# Altium schematic sheet robot.schdoc
size 570 x 404 mm
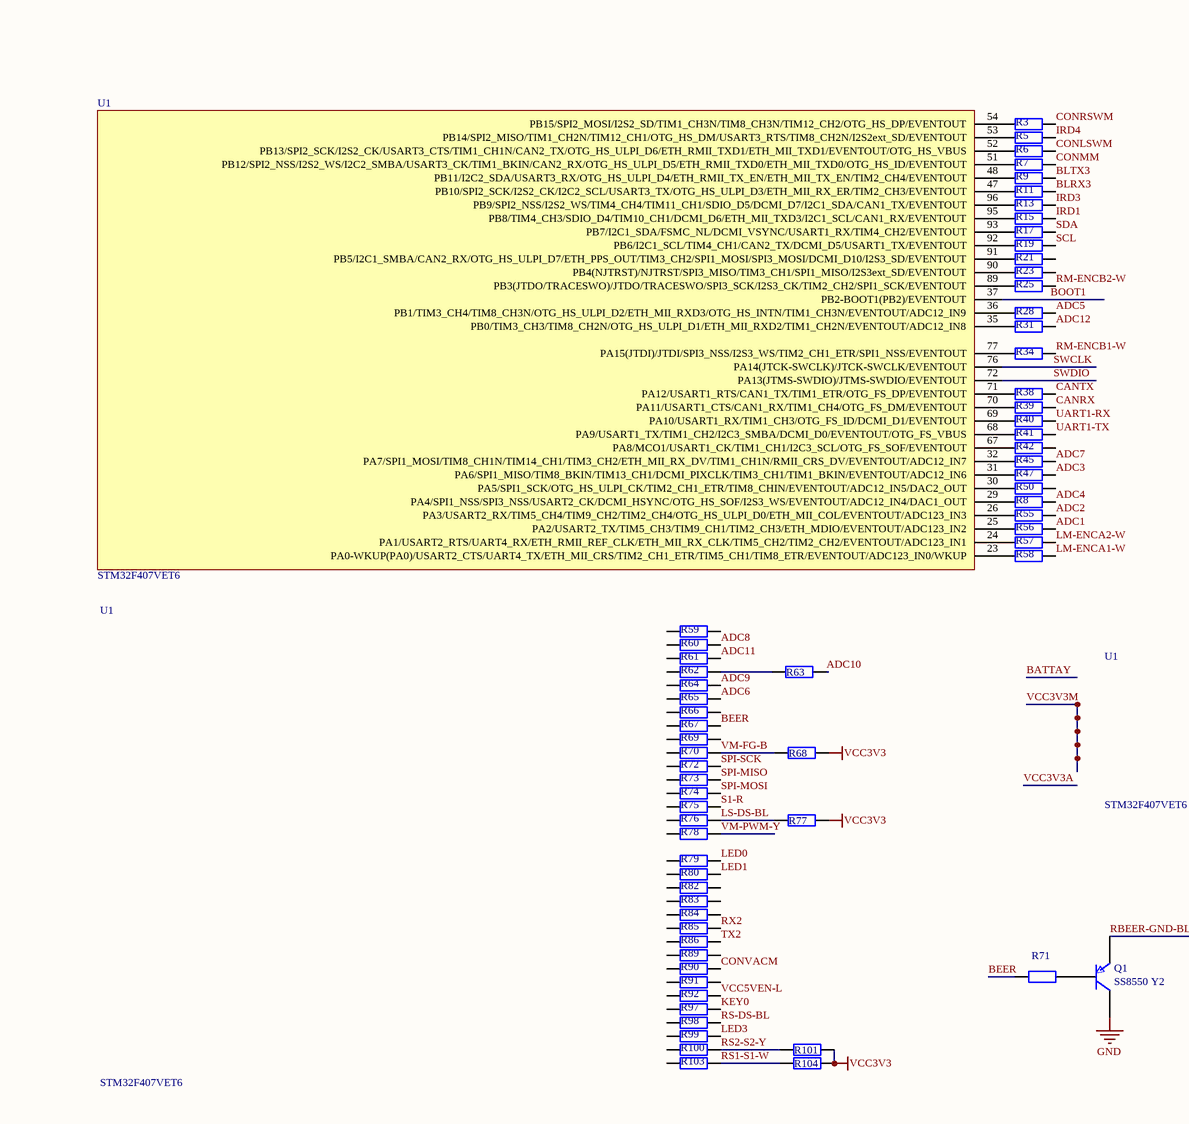
[diagram p0: robot.schdoc, top left]
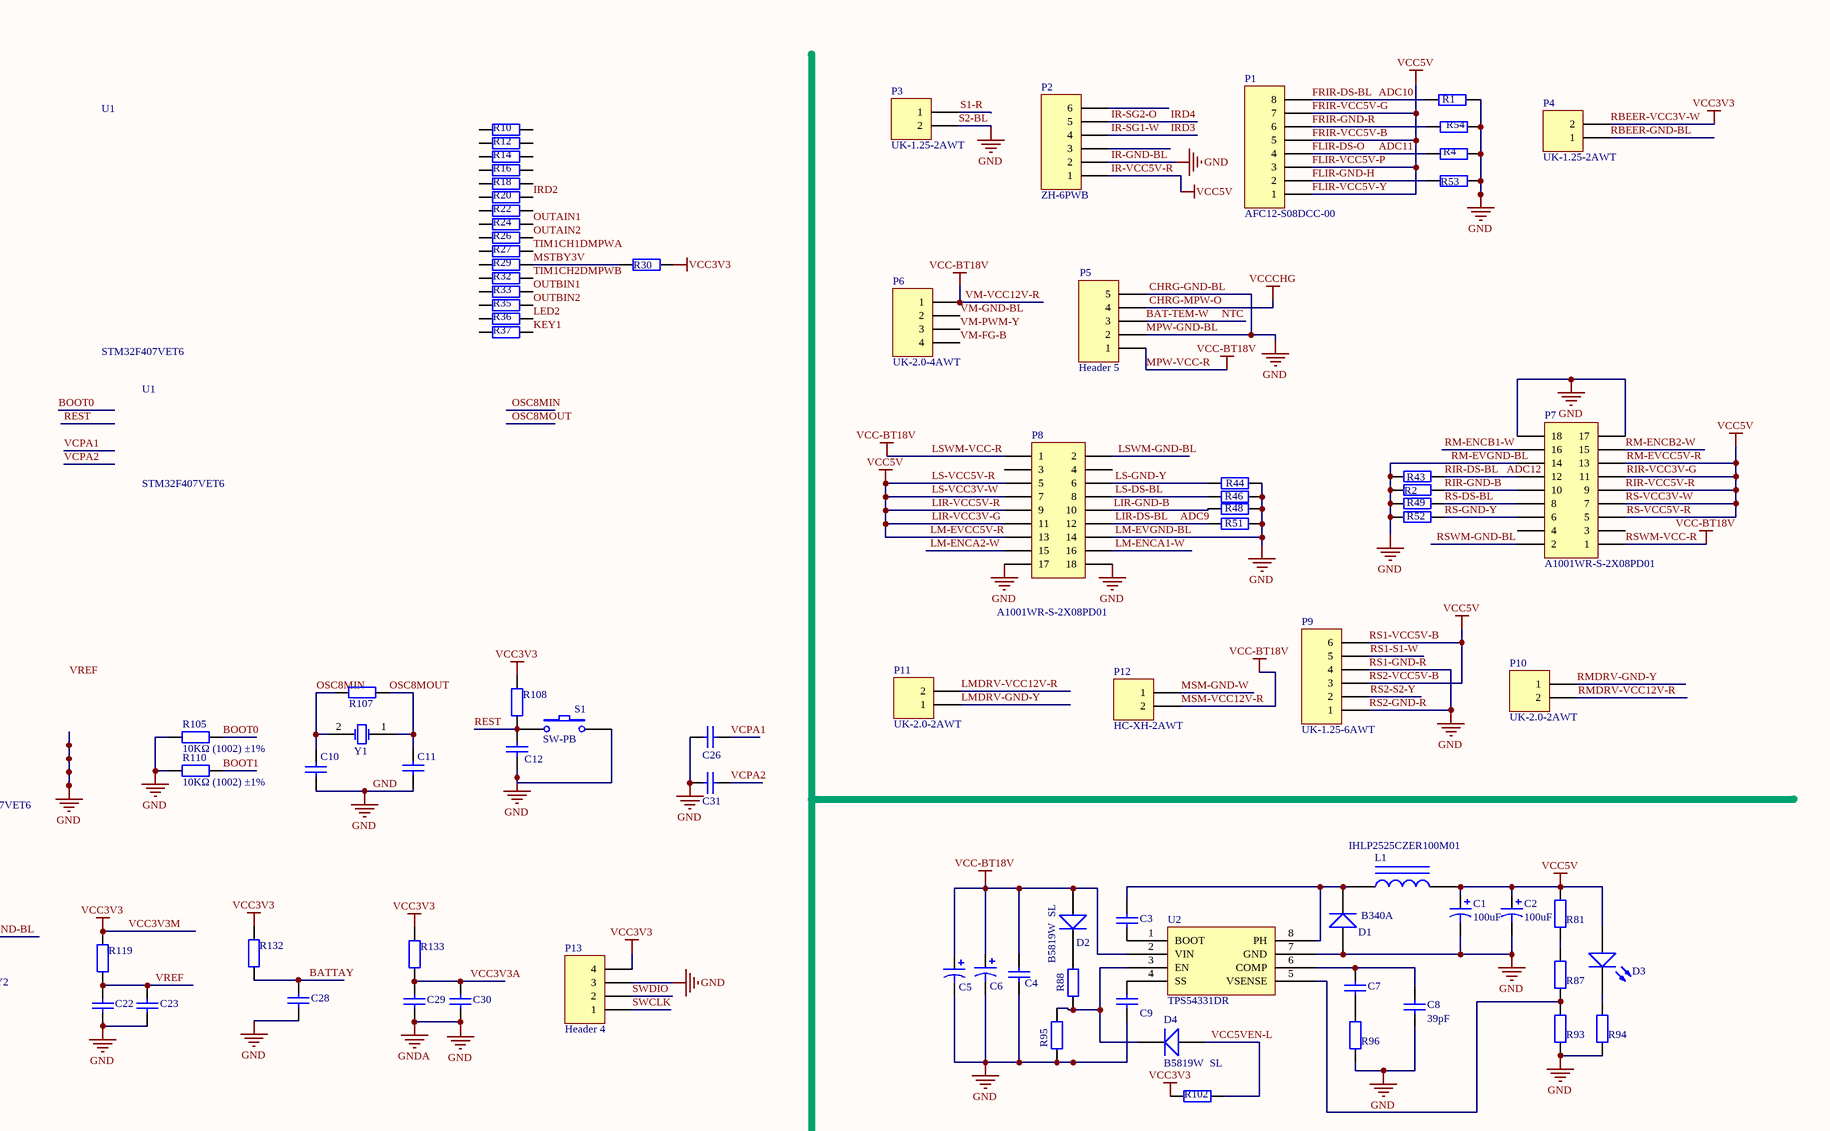
[diagram p1: robot.schdoc, top right]
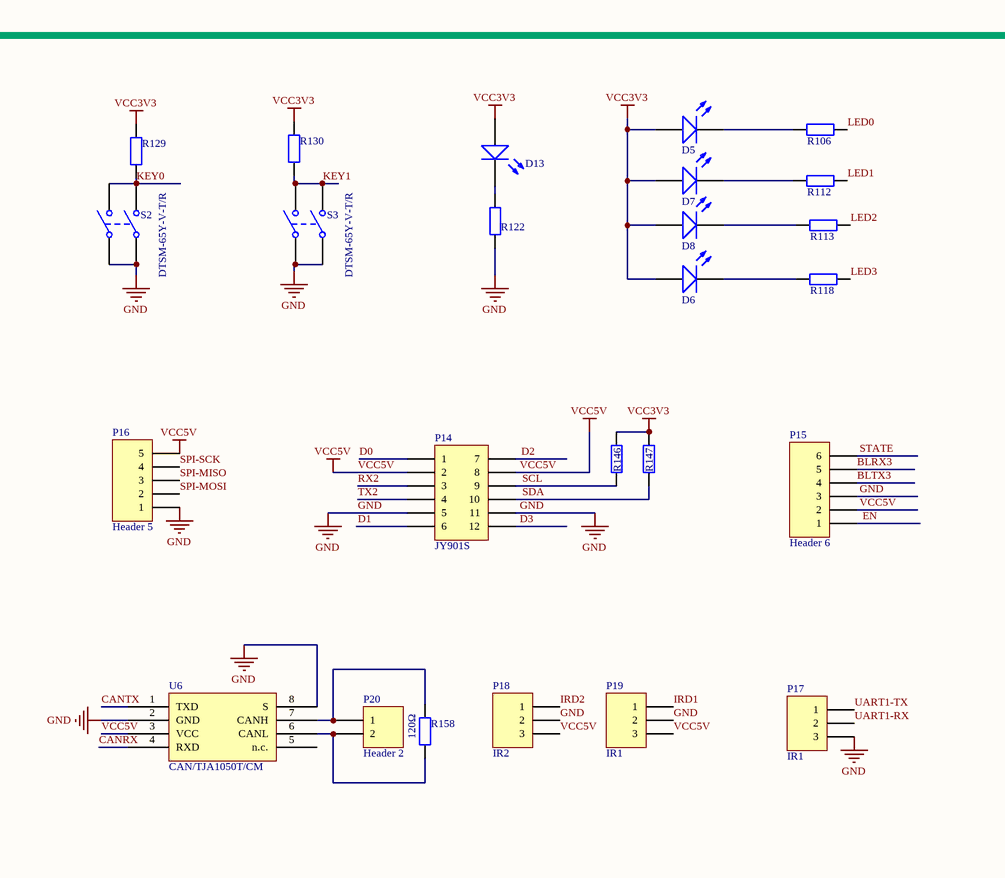
[diagram p2: robot.schdoc, bottom left]
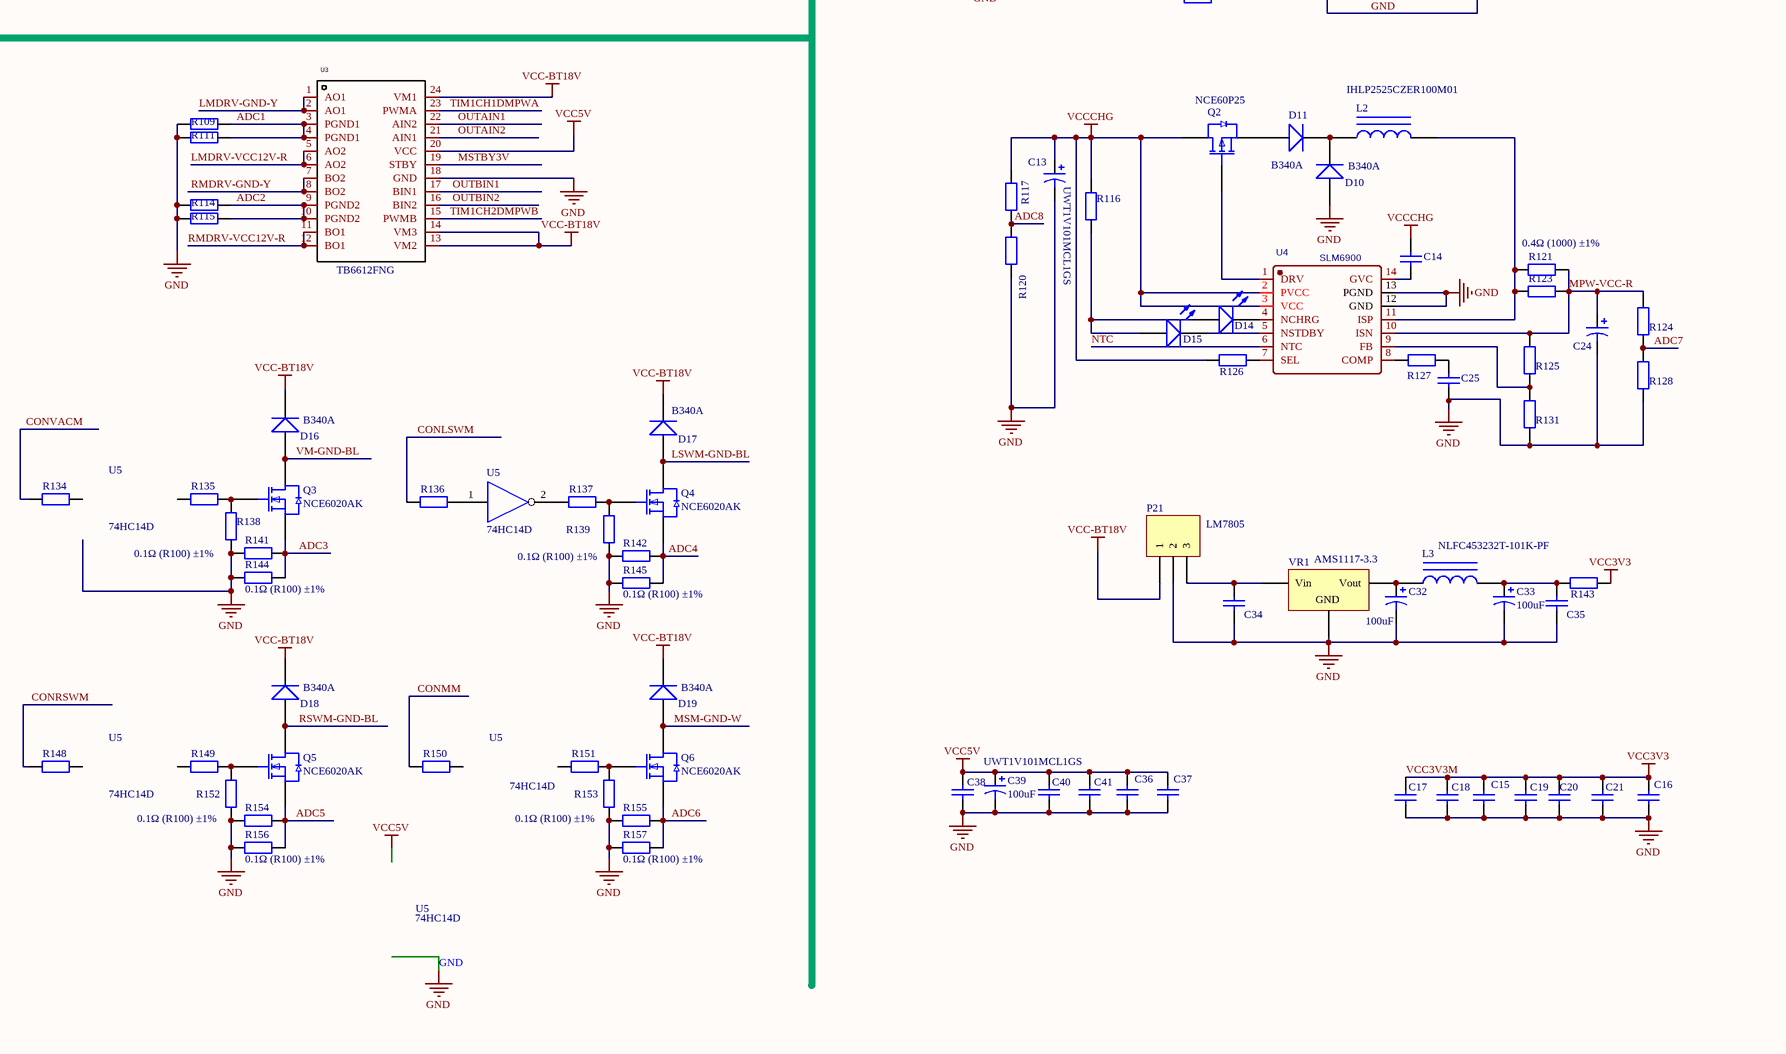
[diagram p3: robot.schdoc, bottom right]

## Parts
(Parts that share a designator on the sheet are numbered #1, #2 ... from top to bottom, then left to right.)
C1  100uF  [SMD6358]
C2  100uF  [SMD6358]
C3  100nF (104) 10% 50V  [0603_C]  (value not drawn)
C4  10nF (103) 10% 50V  [0603_C]  (value not drawn)
C5  100uF  [SMD6358]  (value not drawn)
C6  100uF  [SMD6358]  (value not drawn)
C7  C  [0603_C]  (value not drawn)
C8  39pF  [0603_C]
C9  10nF (103) 10% 50V  [0603_C]  (value not drawn)
C10  22pF 50V  [0603_C]  (value not drawn)
C11  22pF 50V  [0603_C]  (value not drawn)
C12  100nF (104) 10% 50V  [0603_C]  (value not drawn)
C13  100uF  [SMD6358]  (value not drawn)
C14  100nF (104) 10% 50V  [0603_C]  (value not drawn)
C15  100nF (104) 10% 50V  [0603_C]  (value not drawn)
C16  100nF (104) 10% 50V  [0603_C]  (value not drawn)
C17  100nF (104) 10% 50V  [0603_C]  (value not drawn)
C18  100nF (104) 10% 50V  [0603_C]  (value not drawn)
C19  100nF (104) 10% 50V  [0603_C]  (value not drawn)
C20  100nF (104) 10% 50V  [0603_C]  (value not drawn)
C21  100nF (104) 10% 50V  [0603_C]  (value not drawn)
C22  10uF (106) 10% 10V  [0603_C]  (value not drawn)
C23  100nF (104) 10% 50V  [0603_C]  (value not drawn)
C24  100uF  [SMD6358]  (value not drawn)
C25  330nF (334) 10% 25V  [0603_C]  (value not drawn)
C26  2.2uF  10% 10V  [0603_C]  (value not drawn)
C28  100nF (104) 10% 50V  [0603_C]  (value not drawn)
C29  10uF (106) 10% 10V  [0603_C]  (value not drawn)
C30  100nF (104) 10% 50V  [0603_C]  (value not drawn)
C31  2.2uF 10% 10V  [0603_C]  (value not drawn)
C32  100uF  [SMD6358]
C33  100uF  [SMD6358]
C34  10nF (103) 10% 50V  [0603_C]  (value not drawn)
C35  10nF (103) 10% 50V  [0603_C]  (value not drawn)
C36  100nF (104) 10% 50V  [0603_C]  (value not drawn)
C37  100nF (104) 10% 50V  [0603_C]  (value not drawn)
C38  100nF (104) 10% 50V  [0603_C]  (value not drawn)
C39  100uF  [SMD6358]
C40  100nF (104) 10% 50V  [0603_C]  (value not drawn)
C41  100nF (104) 10% 50V  [0603_C]  (value not drawn)
D1  B340A  [LL-34]
D2  B5819W  SL  [SOD-123]
D3  红灯 0603  [0603_LED_S1]  (value not drawn)
D4  B5819W  SL  [SOD-123]
D5  绿灯 0603  [0603_LED_S1]  (value not drawn)
D6  绿灯 0603  [0603_LED_S1]  (value not drawn)
D7  绿灯 0603  [0603_LED_S1]  (value not drawn)
D8  绿灯 0603  [0603_LED_S1]  (value not drawn)
D10  B340A  [LL-34]
D11  B340A  [LL-34]
D13  红灯 0603  [0603_LED_S1]  (value not drawn)
D14  红灯 0603  [0603_LED_S1]  (value not drawn)
D15  绿灯 0603  [0603_LED_S1]  (value not drawn)
D16  B340A  [LL-34]
D17  B340A  [LL-34]
D18  B340A  [LL-34]
D19  B340A  [LL-34]
L1  IHLP2525CZER100M01  [IND-SMD]
L2  IHLP2525CZER100M01  [IND-SMD]
L3  NLFC453232T-101K-PF  [H-SMD-1836]
P1  AFC12-S08DCC-00  [CONN-SMD-8P-1.25]
P2  ZH-6PWB  [CONN-SMD-6P-1.5]
P3  UK-1.25-2AWT  [CONN-SMD-2P-1.25]
P4  UK-1.25-2AWT  [CONN-SMD-2P-1.25]
P5  Header 5  [IP3-5]
P6  UK-2.0-4AWT  [CONN-SMD_4P-P2.00_USAKRO_UK-2.0-4AWT]
P7  A1001WR-S-2X08PD01  [CONN-SMD_A1001WR-S-2X08PD01]
P8  A1001WR-S-2X08PD01  [CONN-SMD_A1001WR-S-2X08PD01]
P9  UK-1.25-6AWT  [CONN-SMD-6P-1.25]
P10  UK-2.0-2AWT  [CONN-SMD_2P-P2.00_USAKRO_UK-2.0-2AWT]
P11  UK-2.0-2AWT  [CONN-SMD_2P-P2.00_USAKRO_UK-2.0-2AWT]
P12  HC-XH-2AWT  [CONN-2.54-2PWT]
P13  Header 4  [HDR1X4]
P14  JY901S  [DIP254-127]
P15  Header 6  [HDR1X6]
P16  Header 5  [HDR1X5]
P17  IR1  [HDR1X3]
P18  IR2  [HDR1X3]
P19  IR1  [HDR1X3]
P20  Header 2  [HDR1X2]
P21  LM7805  [HDR1X3]
Q1  SS8550 Y2  [SOT-23(SOT-23-3)]
Q2  NCE60P25  [PMOS-SO-252]
Q3  NCE6020AK  [NMOS-T252-2]
Q4  NCE6020AK  [NMOS-T252-2]
Q5  NCE6020AK  [NMOS-T252-2]
Q6  NCE6020AK  [NMOS-T252-2]
R1  1K ±1%  [0603_R]  (value not drawn)
R2  51Ω (51R0) ±1%  [0603_R]  (value not drawn)
R3  0Ω (0R0) ±1%  [0402_R]  (value not drawn)
R4  1K ±1%  [0603_R]  (value not drawn)
R5  0Ω (0R0) ±1%  [0402_R]  (value not drawn)
R6  0Ω (0R0) ±1%  [0402_R]  (value not drawn)
R7  0Ω (0R0) ±1%  [0402_R]  (value not drawn)
R8  1K ±1%  [0402_R]  (value not drawn)
R9  0Ω (0R0) ±1%  [0402_R]  (value not drawn)
R10  0Ω (0R0) ±1%  [0402_R]  (value not drawn)
R11  0Ω (0R0) ±1%  [0402_R]  (value not drawn)
R12  0Ω (0R0) ±1%  [0402_R]  (value not drawn)
R13  0Ω (0R0) ±1%  [0402_R]  (value not drawn)
R14  0Ω (0R0) ±1%  [0402_R]  (value not drawn)
R15  0Ω (0R0) ±1%  [0402_R]  (value not drawn)
R16  0Ω (0R0) ±1%  [0402_R]  (value not drawn)
R17  0Ω (0R0) ±1%  [0402_R]  (value not drawn)
R18  0Ω (0R0) ±1%  [0402_R]  (value not drawn)
R19  0Ω (0R0) ±1%  [0402_R]  (value not drawn)
R20  0Ω (0R0) ±1%  [0402_R]  (value not drawn)
R21  0Ω (0R0) ±1%  [0402_R]  (value not drawn)
R22  0Ω (0R0) ±1%  [0402_R]  (value not drawn)
R23  0Ω (0R0) ±1%  [0402_R]  (value not drawn)
R24  0Ω (0R0) ±1%  [0402_R]  (value not drawn)
R25  0Ω (0R0) ±1%  [0402_R]  (value not drawn)
R26  0Ω (0R0) ±1%  [0402_R]  (value not drawn)
R27  0Ω (0R0) ±1%  [0402_R]  (value not drawn)
R28  1K ±1%  [0402_R]  (value not drawn)
R29  0Ω (0R0) ±1%  [0402_R]  (value not drawn)
R30  100KΩ (1003) ±1%  [0603_R]  (value not drawn)
R31  1K ±1%  [0402_R]  (value not drawn)
R32  0Ω (0R0) ±1%  [0402_R]  (value not drawn)
R33  0Ω (0R0) ±1%  [0402_R]  (value not drawn)
R34  0Ω (0R0) ±1%  [0402_R]  (value not drawn)
R35  0Ω (0R0) ±1%  [0402_R]  (value not drawn)
R36  0Ω (0R0) ±1%  [0402_R]  (value not drawn)
R37  0Ω (0R0) ±1%  [0402_R]  (value not drawn)
R38  0Ω (0R0) ±1%  [0402_R]  (value not drawn)
R39  0Ω (0R0) ±1%  [0402_R]  (value not drawn)
R40  0Ω (0R0) ±1%  [0402_R]  (value not drawn)
R41  0Ω (0R0) ±1%  [0402_R]  (value not drawn)
R42  0Ω (0R0) ±1%  [0402_R]  (value not drawn)
R43  5.1K ±1%  [0603_R]  (value not drawn)
R44  51Ω (51R0) ±1%  [0603_R]  (value not drawn)
R45  1K ±1%  [0402_R]  (value not drawn)
R46  1K ±1%  [0603_R]  (value not drawn)
R47  1K ±1%  [0402_R]  (value not drawn)
R48  51Ω (51R0) ±1%  [0603_R]  (value not drawn)
R49  1K ±1%  [0603_R]  (value not drawn)
R50  0Ω (0R0) ±1%  [0402_R]  (value not drawn)
R51  5.1K ±1%  [0603_R]  (value not drawn)
R52  51Ω (51R0) ±1%  [0603_R]  (value not drawn)
R53  51Ω (51R0) ±1%  [0603_R]  (value not drawn)
R54  51Ω (51R0) ±1%  [0603_R]  (value not drawn)
R55  1K ±1%  [0402_R]  (value not drawn)
R56  1K ±1%  [0402_R]  (value not drawn)
R57  0Ω (0R0) ±1%  [0402_R]  (value not drawn)
R58  0Ω (0R0) ±1%  [0402_R]  (value not drawn)
R59  0Ω (0R0) ±1%  [0402_R]  (value not drawn)
R60  1K ±1%  [0402_R]  (value not drawn)
R61  1K±1%  [0402_R]  (value not drawn)
R62  0Ω (0R0) ±1%  [0402_R]  (value not drawn)
R63  1KΩ  ±1%  [0603_R]  (value not drawn)
R64  1K ±1%  [0402_R]  (value not drawn)
R65  1K ±1%  [0402_R]  (value not drawn)
R66  0Ω (0R0) ±1%  [0402_R]  (value not drawn)
R67  0Ω (0R0) ±1%  [0402_R]  (value not drawn)
R68  100KΩ (1003) ±1%  [0603_R]  (value not drawn)
R69  0Ω (0R0) ±1%  [0402_R]  (value not drawn)
R70  0Ω (0R0) ±1%  [0402_R]  (value not drawn)
R71  1K ±1%  [0603_R]  (value not drawn)
R72  0Ω (0R0) ±1%  [0402_R]  (value not drawn)
R73  0Ω (0R0) ±1%  [0402_R]  (value not drawn)
R74  0Ω (0R0) ±1%  [0402_R]  (value not drawn)
R75  0Ω (0R0) ±1%  [0402_R]  (value not drawn)
R76  0Ω (0R0) ±1%  [0402_R]  (value not drawn)
R77  100KΩ (1003) ±1%  [0603_R]  (value not drawn)
R78  0Ω (0R0) ±1%  [0402_R]  (value not drawn)
R79  0Ω (0R0) ±1%  [0402_R]  (value not drawn)
R80  0Ω (0R0) ±1%  [0402_R]  (value not drawn)
R81  0Ω (0R0) ±1%  [0603_R]  (value not drawn)
R82  0Ω (0R0) ±1%  [0402_R]  (value not drawn)
R83  0Ω (0R0) ±1%  [0402_R]  (value not drawn)
R84  0Ω (0R0) ±1%  [0402_R]  (value not drawn)
R85  0Ω (0R0) ±1%  [0402_R]  (value not drawn)
R86  0Ω (0R0) ±1%  [0402_R]  (value not drawn)
R87  10.2KΩ (1002) ±1%  [0603_R]  (value not drawn)
R88  330KΩ  ±1%  [0603_R]  (value not drawn)
R89  0Ω (0R0) ±1%  [0402_R]  (value not drawn)
R90  0Ω (0R0) ±1%  [0402_R]  (value not drawn)
R91  0Ω (0R0) ±1%  [0402_R]  (value not drawn)
R92  0Ω (0R0) ±1%  [0402_R]  (value not drawn)
R93  1.91KΩ (1002) ±1%  [0603_R]  (value not drawn)
R94  10KΩ (1002) ±1%  [0603_R]  (value not drawn)
R95  68KΩ  [0603_R]  (value not drawn)
R96  50KΩ (1002) ±1%  [0603_R]  (value not drawn)
R97  0Ω (0R0) ±1%  [0402_R]  (value not drawn)
R98  0Ω (0R0) ±1%  [0402_R]  (value not drawn)
R99  0Ω (0R0) ±1%  [0402_R]  (value not drawn)
R100  0Ω (0R0) ±1%  [0402_R]  (value not drawn)
R101  100KΩ (1003) ±1%  [0603_R]  (value not drawn)
R102  31KΩ ±1%  [0603_R]  (value not drawn)
R103  0Ω (0R0) ±1%  [0402_R]  (value not drawn)
R104  100KΩ (1003) ±1%  [0603_R]  (value not drawn)
R105  10KΩ (1002) ±1%  [0402_R]
R106  5.1KΩ ±1%  [0603_R]  (value not drawn)
R107  1MΩ (1004) ±1%  [0603_R]  (value not drawn)
R108  10KΩ (1002) ±1%  [0603_R]  (value not drawn)
R109  0.1Ω (R100) ±1%  [R2512]  (value not drawn)
R110  10KΩ (1002) ±1%  [0402_R]
R111  0.1Ω (R100) ±1%  [R2512]  (value not drawn)
R112  5.1KΩ  ±1%  [0603_R]  (value not drawn)
R113  2KΩ (2002) ±1%  [0603_R]  (value not drawn)
R114  0.1Ω (R100) ±1%  [R2512]  (value not drawn)
R115  0.1Ω (R100) ±1%  [R2512]  (value not drawn)
R116  4.7KΩ (4701) ±1%  [0603_R]  (value not drawn)
R117  20K  [0603_R]  (value not drawn)
R118  2KΩ (2002) ±1%  [0603_R]  (value not drawn)
R119  1Ω  ±1%  [0603_R]  (value not drawn)
R120  3K  [0603_R]  (value not drawn)
R121  0.4Ω (1000) ±1%  [1206_R]
R122  5.1KΩ ±1%  [0603_R]  (value not drawn)
R123  0.4Ω (1000) ±1%  [1206_R]  (value not drawn)
R124  20k  [0603_R]  (value not drawn)
R125  120Ω (1200) ±1%  [0603_R]  (value not drawn)
R126  120Ω (1200) ±1%  [0603_R]  (value not drawn)
R127  120Ω (1200) ±1%  [0603_R]  (value not drawn)
R128  3K  [0603_R]  (value not drawn)
R129  10KΩ (1002) ±1%  [0603_R]  (value not drawn)
R130  10KΩ (1002) ±1%  [0603_R]  (value not drawn)
R131  39.3K ±1%  [0603_R]  (value not drawn)
R132  10Ω  ±1%  [0603_R]  (value not drawn)
R133  1Ω  ±1%  [0603_R]  (value not drawn)
R134  1KΩ (1001) ±1%  [0603_R]  (value not drawn)
R135  1KΩ (1001) ±1%  [0603_R]  (value not drawn)
R136  1KΩ (1001) ±1%  [0603_R]  (value not drawn)
R137  1KΩ (1001) ±1%  [0603_R]  (value not drawn)
R138  100KΩ (1003) ±1%  [0603_R]  (value not drawn)
R139  100KΩ (1003) ±1%  [0603_R]  (value not drawn)
R141  0.1Ω (R100) ±1%  [R2512]
R142  0.1Ω (R100) ±1%  [R2512]
R143  0Ω (0R0) ±1%  [0603_R]  (value not drawn)
R144  0.1Ω (R100) ±1%  [R2512]
R145  0.1Ω (R100) ±1%  [R2512]
R146  10KΩ (1002) ±1%  [0603_R]  (value not drawn)
R147  10KΩ (1002) ±1%  [0603_R]  (value not drawn)
R148  1KΩ (1001) ±1%  [0603_R]  (value not drawn)
R149  1KΩ (1001) ±1%  [0603_R]  (value not drawn)
R150  1KΩ (1001) ±1%  [0603_R]  (value not drawn)
R151  1KΩ (1001) ±1%  [0603_R]  (value not drawn)
R152  100KΩ (1003) ±1%  [0603_R]  (value not drawn)
R153  100KΩ (1003) ±1%  [0603_R]  (value not drawn)
R154  0.1Ω (R100) ±1%  [R2512]
R155  0.1Ω (R100) ±1%  [R2512]
R156  0.1Ω (R100) ±1%  [R2512]
R157  0.1Ω (R100) ±1%  [R2512]
R158  120Ω  [1206_R]
S1  SW-PB  [SW-SMD-L1.6-W3.3]
S2  DTSM-65Y-V-T/R  [SW-SMD_4P-L6.0-W6.0-P4.50-LS8.6]
S3  DTSM-65Y-V-T/R  [SW-SMD_4P-L6.0-W6.0-P4.50-LS8.6]
U1#1  STM32F407VET6  [LQFP-100_14X14X05P]
U1#2  STM32F407VET6  [LQFP-100_14X14X05P]
U1#3  STM32F407VET6  [LQFP-100_14X14X05P]
U1#4  STM32F407VET6  [LQFP-100_14X14X05P]
U1#5  STM32F407VET6  [LQFP-100_14X14X05P]
U2  TPS54331DR  [SOIC-8_150MIL]
U3  TB6612FNG  [SSOP-24]
U4  SLM6900  [TSSOP145065]
U5#1  74HC14D  [SOIC-14_150MIL]
U5#2  74HC14D  [SOIC-14_150MIL]
U5#3  74HC14D  [SOIC-14_150MIL]
U5#4  74HC14D  [SOIC-14_150MIL]
U5#5  74HC14D  [SOIC-14_150MIL]
U6  CAN/TJA1050T/CM  [SOIC-8_150MIL]
VR1  AMS1117-3.3  [SOT89 - DUPLICATE]
Y1  8MHz ±20ppm 20pF  [SMD-5032_2P]  (value not drawn)

## Nets
CHRG-GND-BL: C1.2 C2.2 C4.1 C5.2 C6.2 C8.1 C9.1 C10.1 C11.1 C12.1 C13.2 C15.1 C16.1 C17.1 C18.1 C19.1 C20.1 C21.1 C22.1 C23.1 C24.2 C25.1 C26.1 C28.1 C29.1 C30.1 C31.1 C32.2 C33.2 C34.1 C35.1 C36.1 C37.1 C38.1 C39.2 C40.1 C41.1 D1.1(A) D10.1(A) P2.2 P3.2 P5.2 P5.5 P7.14 P7.17 P7.18 P8.14 P8.17 P8.18 P9.1 P9.4 P13.3 P14.5 P14.11 P15.3 P16.1 P17.3 P18.2 P19.2 P21.2 Q1.3(C) R1.2 R2.2 R4.2 R43.1 R44.2 R46.2 R48.1 R49.1 R51.2 R52.1 R53.2 R54.2 R93.1 R94.1 R95.1 R96.1 R105.1 R109.1 R110.1 R111.1 R114.1 R115.1 R120.2 R122.1 R128.1 R131.2 R138.1 R139.1 R141.1 R142.1 R144.1 R145.1 R152.1 R153.1 R154.1 R155.1 R156.1 R157.1 S1.2 S2.1(COMMON1) S2.3(COMMON2) S3.1(COMMON1) S3.3(COMMON2) U2.7(GND) U3.18(GND) U4.12(GND) U4.13(PGND) U6.2(GND) U6.8(S) VR1.1(GND)  [also labelled GND, GNDA, IR-GND-BL, LM-EVGND-BL, MPW-GND-BL, RM-EVGND-BL, RS1-GND-R, RS2-GND-R, S2-BL]
CHRG-MPW-O: C13.1 C14.2 P5.4 Q2.3(D) R116.2 R117.1 R126.1 U4.2(PVCC) U4.3(VCC)  [also labelled VCCCHG]
FLIR-VCC5V-P: C1.1 C2.1 C36.2 C37.2 C38.2 C39.1 C40.2 C41.2 D3.A L1.2 P1.1 P1.3 P1.5 P1.7 P2.1 P7.5 P7.7 P7.9 P7.11 P7.13 P8.5 P8.7 P8.9 P8.11 P8.13 P9.3 P9.6 P14.2 P14.8 P15.2 P16.5 P18.3 P19.3 R81.2 U3.20(VCC) U6.3(VCC)  [also labelled FLIR-VCC5V-Y, FRIR-VCC5V-B, FRIR-VCC5V-G, IR-VCC5V-R, LIR-VCC3V-G, LIR-VCC5V-R, LM-EVCC5V-R, LS-VCC3V-W, LS-VCC5V-R, RIR-VCC3V-G, RIR-VCC5V-R, RM-EVCC5V-R, RS-VCC3V-W, RS-VCC5V-R, RS1-VCC5V-B, RS2-VCC5V-B, VCC5V]
LSWM-VCC-R: C4.2 C5.1 C6.1 C24.1 D2.1(A) D16.2(K) D17.2(K) D18.2(K) D19.2(K) P5.1 P6.1 P7.1 P8.1 P12.2 P21.1 R121.2 R123.2 R124.2 R125.1 U2.2(VIN) U3.13(VM2) U3.14(VM3) U3.24(VM1) U4.10(ISN)  [also labelled MPW-VCC-R, MSM-VCC12V-R, RSWM-VCC-R, VCC-BT18V, VM-VCC12V-R]
RBEER-VCC3V-W: C15.2 C16.2 C17.2 C18.2 C19.2 C20.2 C21.2 D5.A D6.A D7.A D8.A D13.A P4.2 P13.4 R30.2 R68.2 R77.2 R101.2 R102.1 R104.2 R108.2 R119.2 R129.2 R130.2 R132.2 R133.2 R143.1 R146.2 R147.2  [also labelled VCC3V3, VCC3V3M]
ADC1: R56.2 R109.2 R111.2 U3.3(PGND1) U3.4(PGND1)
ADC2: R55.2 R114.2 R115.2 U3.9(PGND2) U3.10(PGND2)
ADC3: Q3.2(S) R47.2 R141.2 R144.2
ADC4: Q4.2(S) R8.2 R142.2 R145.2
ADC5: Q5.2(S) R28.2 R154.2 R156.2
ADC6: Q6.2(S) R65.2 R155.2 R157.2
ADC7: R45.2 R124.1 R128.2
ADC8: R60.2 R117.2 R120.1
ADC9: P8.12 R51.1 R64.2  [also labelled LIR-DS-BL]
ADC10: P1.8 R1.1 R63.2  [also labelled FRIR-DS-BL]
ADC11: P1.4 R4.1 R61.2  [also labelled FLIR-DS-O]
ADC12: P7.12 R31.2 R43.2  [also labelled RIR-DS-BL]
BAT-TEM-W: P5.3 U4.6(NTC)  [also labelled NTC]
BATTAY: C28.2 R132.1
BEER: R67.2 R71.1
BLRX3: P15.5 R11.2
BLTX3: P15.4 R9.2
BOOT0: R105.2
BOOT1: R110.2 U1#2.37(PB2-BOOT1(PB2)/EVENTOUT)
CANRX: R39.2 U6.4(RXD)
CANTX: R38.2 U6.1(TXD)
CONLSWM: R6.2 R136.1
CONMM: R7.2 R150.1
CONRSWM: R3.2 R148.1
CONVACM: R90.2 R134.1
D0: P14.1
D1: P14.6
D2: P14.7
D3: P14.12
EN: P15.1
FLIR-GND-H: P1.2 R53.1
FRIR-GND-R: P1.6 R54.1
IR-SG1-W: P2.4 R13.2  [also labelled IRD3]
IR-SG2-O: P2.5 R5.2  [also labelled IRD4]
IRD1: P19.1 R15.2
IRD2: P18.1 R20.2
KEY0: R97.2 R129.1 S2.2(NO1) S2.4(NO2)
KEY1: R37.2 R130.1 S3.2(NO1) S3.4(NO2)
LED0: R79.2 R106.1
LED1: R80.2 R112.1
LED2: R36.2 R113.1
LED3: R99.2 R118.1
LIR-GND-B: P8.10 R48.2
LM-ENCA1-W: P8.16 R58.2
LM-ENCA2-W: P8.15 R57.2
LMDRV-GND-Y: P11.1 U3.1(AO1) U3.2(AO1)
LMDRV-VCC12V-R: P11.2 U3.5(AO2) U3.6(AO2)
LS-DS-BL: P8.8 R46.1 R76.2 R77.1
LS-GND-Y: P8.6 R44.1
LSWM-GND-BL: D17.1(A) P8.2 Q4.3(D)
MSM-GND-W: D19.1(A) P12.1 Q6.3(D)
MSTBY3V: R29.2 R30.1 U3.19(STBY)
OSC8MIN: C10.2 R107.2 Y1.2(OSC2)
OSC8MOUT: C11.2 R107.1 Y1.1(OSC1)
OUTAIN1: R24.2 U3.22(AIN2)
OUTAIN2: R26.2 U3.21(AIN1)
OUTBIN1: R33.2 U3.17(BIN1)
OUTBIN2: R35.2 U3.16(BIN2)
RBEER-GND-BL: P4.1 Q1.2(E)
REST: C12.2 R108.1 S1.1
RIR-GND-B: P7.10 R2.1
RM-ENCB1-W: P7.16 R34.2
RM-ENCB2-W: P7.15 R25.2
RMDRV-GND-Y: P10.1 U3.7(BO2) U3.8(BO2)
RMDRV-VCC12V-R: P10.2 U3.11(BO1) U3.12(BO1)
RS1-S1-W: P9.5 R103.2 R104.1
RS2-S2-Y: P9.2 R100.2 R101.1
RS-DS-BL: P7.8 R49.2 R98.2
RS-GND-Y: P7.6 R52.2
RSWM-GND-BL: D18.1(A) P7.2 Q5.3(D)
RX2: P14.3 R85.2
S1-R: P3.1 R75.2
SCL: P14.9 R19.2 R146.1
SDA: P14.10 R17.2 R147.1
SPI-MISO: P16.3 R73.2
SPI-MOSI: P16.2 R74.2
SPI-SCK: P16.4 R72.2
STATE: P15.6
SWCLK: P13.1 U1#2.76(PA14(JTCK-SWCLK)/JTCK-SWCLK/EVENTOUT)
SWDIO: P13.2 U1#2.72(PA13(JTMS-SWDIO)/JTMS-SWDIO/EVENTOUT)
TIM1CH1DMPWA: R27.2 U3.23(PWMA)
TIM1CH2DMPWB: R32.2 U3.15(PWMB)
TX2: P14.4 R86.2
UART1-RX: P17.2 R40.2
UART1-TX: P17.1 R41.2
VCC3V3A: C29.2 C30.2 R133.1
VCC5VEN-L: D4.1(A) R92.2 R102.2
VCPA1: C26.2
VCPA2: C31.2
VM-FG-B: P6.4 R68.1 R70.2
VM-GND-BL: D16.1(A) P6.2 Q3.3(D)
VM-PWM-Y: P6.3 R78.2
VREF: C22.2 C23.2 R119.1
NetC3_1: C3.1 U2.1(BOOT)
NetC3_2: C3.2 D1.2(K) L1.1 U2.8(PH)
NetC7_1: C7.1 R96.2
NetC7_2: C7.2 C8.2 U2.6(COMP)
NetC9_2: C9.2 U2.4(SS)
NetC14_1: C14.1 U4.14(GVC)
NetC25_2: C25.2 R127.1
NetC32_1: C32.1 L3.1 VR1.2(Vout)
NetC33_1: C33.1 C35.2 L3.2 R143.2
NetC34_2: C34.2 P21.3 VR1.3(Vin)
NetD2_2: D2.2(K) R88.2
NetD3_K: D3.K R94.2
NetD4_2: D4.2(K) R88.1 R95.2 U2.3(EN)
NetD5_K: D5.K R106.2
NetD6_K: D6.K R118.2
NetD7_K: D7.K R112.2
NetD8_K: D8.K R113.2
NetD10_2: D10.2(K) D11.2(K) L2.1
NetD11_1: D11.1(A) Q2.2(S)
NetD13_K: D13.K R122.2
NetD14_A: D14.A D15.A R116.1
NetD14_K: D14.K U4.4(NCHRG)
NetD15_K: D15.K U4.5(NSTDBY)
NetL2_2: L2.2 R121.1 R123.1 U4.11(ISP)
NetP20_1: P20.1 R158.1 U6.7(CANH)
NetP20_2: P20.2 R158.2 U6.6(CANL)
NetQ1_1: Q1.1(B) R71.2
NetQ2_1: Q2.1(G) U4.1(DRV)
NetQ3_1: Q3.1(G) R135.2 R138.2
NetQ4_1: Q4.1(G) R137.2 R139.2
NetQ5_1: Q5.1(G) R149.2 R152.2
NetQ6_1: Q6.1(G) R151.2 R153.2
NetR3_1: R3.1 U1#2.54(PB15/SPI2_MOSI/I2S2_SD/TIM1_CH3N/TIM8_CH3N/TIM12_CH2/OTG_HS_DP/EVENTOUT)
NetR5_1: R5.1 U1#2.53(PB14/SPI2_MISO/TIM1_CH2N/TIM12_CH1/OTG_HS_DM/USART3_RTS/TIM8_CH2N/I2S2ext_SD/EVENTOUT)
NetR6_1: R6.1 U1#2.52(PB13/SPI2_SCK/I2S2_CK/USART3_CTS/TIM1_CH1N/CAN2_TX/OTG_HS_ULPI_D6/ETH_RMII_TXD1/ETH_MII_TXD1/EVENTOUT/OTG_HS_VBUS)
NetR7_1: R7.1 U1#2.51(PB12/SPI2_NSS/I2S2_WS/I2C2_SMBA/USART3_CK/TIM1_BKIN/CAN2_RX/OTG_HS_ULPI_D5/ETH_RMII_TXD0/ETH_MII_TXD0/OTG_HS_ID/EVENTOUT)
NetR8_1: R8.1 U1#2.29(PA4/SPI1_NSS/SPI3_NSS/USART2_CK/DCMI_HSYNC/OTG_HS_SOF/I2S3_WS/EVENTOUT/ADC12_IN4/DAC1_OUT)
NetR9_1: R9.1 U1#2.48(PB11/I2C2_SDA/USART3_RX/OTG_HS_ULPI_D4/ETH_RMII_TX_EN/ETH_MII_TX_EN/TIM2_CH4/EVENTOUT)
NetR11_1: R11.1 U1#2.47(PB10/SPI2_SCK/I2S2_CK/I2C2_SCL/USART3_TX/OTG_HS_ULPI_D3/ETH_MII_RX_ER/TIM2_CH3/EVENTOUT)
NetR13_1: R13.1 U1#2.96(PB9/SPI2_NSS/I2S2_WS/TIM4_CH4/TIM11_CH1/SDIO_D5/DCMI_D7/I2C1_SDA/CAN1_TX/EVENTOUT)
NetR15_1: R15.1 U1#2.95(PB8/TIM4_CH3/SDIO_D4/TIM10_CH1/DCMI_D6/ETH_MII_TXD3/I2C1_SCL/CAN1_RX/EVENTOUT)
NetR17_1: R17.1 U1#2.93(PB7/I2C1_SDA/FSMC_NL/DCMI_VSYNC/USART1_RX/TIM4_CH2/EVENTOUT)
NetR19_1: R19.1 U1#2.92(PB6/I2C1_SCL/TIM4_CH1/CAN2_TX/DCMI_D5/USART1_TX/EVENTOUT)
NetR21_1: R21.1 U1#2.91(PB5/I2C1_SMBA/CAN2_RX/OTG_HS_ULPI_D7/ETH_PPS_OUT/TIM3_CH2/SPI1_MOSI/SPI3_MOSI/DCMI_D10/I2S3_SD/EVENTOUT)
NetR23_1: R23.1 U1#2.90(PB4(NJTRST)/NJTRST/SPI3_MISO/TIM3_CH1/SPI1_MISO/I2S3ext_SD/EVENTOUT)
NetR25_1: R25.1 U1#2.89(PB3(JTDO/TRACESWO)/JTDO/TRACESWO/SPI3_SCK/I2S3_CK/TIM2_CH2/SPI1_SCK/EVENTOUT)
NetR28_1: R28.1 U1#2.36(PB1/TIM3_CH4/TIM8_CH3N/OTG_HS_ULPI_D2/ETH_MII_RXD3/OTG_HS_INTN/TIM1_CH3N/EVENTOUT/ADC12_IN9)
NetR31_1: R31.1 U1#2.35(PB0/TIM3_CH3/TIM8_CH2N/OTG_HS_ULPI_D1/ETH_MII_RXD2/TIM1_CH2N/EVENTOUT/ADC12_IN8)
NetR34_1: R34.1 U1#2.77(PA15(JTDI)/JTDI/SPI3_NSS/I2S3_WS/TIM2_CH1_ETR/SPI1_NSS/EVENTOUT)
NetR38_1: R38.1 U1#2.71(PA12/USART1_RTS/CAN1_TX/TIM1_ETR/OTG_FS_DP/EVENTOUT)
NetR39_1: R39.1 U1#2.70(PA11/USART1_CTS/CAN1_RX/TIM1_CH4/OTG_FS_DM/EVENTOUT)
NetR40_1: R40.1 U1#2.69(PA10/USART1_RX/TIM1_CH3/OTG_FS_ID/DCMI_D1/EVENTOUT)
NetR41_1: R41.1 U1#2.68(PA9/USART1_TX/TIM1_CH2/I2C3_SMBA/DCMI_D0/EVENTOUT/OTG_FS_VBUS)
NetR42_1: R42.1 U1#2.67(PA8/MCO1/USART1_CK/TIM1_CH1/I2C3_SCL/OTG_FS_SOF/EVENTOUT)
NetR45_1: R45.1 U1#2.32(PA7/SPI1_MOSI/TIM8_CH1N/TIM14_CH1/TIM3_CH2/ETH_MII_RX_DV/TIM1_CH1N/RMII_CRS_DV/EVENTOUT/ADC12_IN7)
NetR47_1: R47.1 U1#2.31(PA6/SPI1_MISO/TIM8_BKIN/TIM13_CH1/DCMI_PIXCLK/TIM3_CH1/TIM1_BKIN/EVENTOUT/ADC12_IN6)
NetR50_1: R50.1 U1#2.30(PA5/SPI1_SCK/OTG_HS_ULPI_CK/TIM2_CH1_ETR/TIM8_CHIN/EVENTOUT/ADC12_IN5/DAC2_OUT)
NetR55_1: R55.1 U1#2.26(PA3/USART2_RX/TIM5_CH4/TIM9_CH2/TIM2_CH4/OTG_HS_ULPI_D0/ETH_MII_COL/EVENTOUT/ADC123_IN3)
NetR56_1: R56.1 U1#2.25(PA2/USART2_TX/TIM5_CH3/TIM9_CH1/TIM2_CH3/ETH_MDIO/EVENTOUT/ADC123_IN2)
NetR57_1: R57.1 U1#2.24(PA1/USART2_RTS/UART4_RX/ETH_RMII_REF_CLK/ETH_MII_RX_CLK/TIM5_CH2/TIM2_CH2/EVENTOUT/ADC123_IN1)
NetR58_1: R58.1 U1#2.23(PA0-WKUP(PA0)/USART2_CTS/UART4_TX/ETH_MII_CRS/TIM2_CH1_ETR/TIM5_CH1/TIM8_ETR/EVENTOUT/ADC123_IN0/WKUP)
NetR62_2: R62.2 R63.1
NetR81_1: R81.1 R87.2
NetR87_1: R87.1 R93.2 U2.5(VSENSE)
NetR125_2: R125.2 R131.1 U4.9(FB)
NetR126_2: R126.2 U4.7(SEL)
NetR127_2: R127.2 U4.8(COMP)
NetR136_2: R136.2 U5#2.1(A)
NetR137_1: R137.1 U5#2.2(Y)

Not connected (* = marked no-connect by the designer): P2 3 6; P7 3 4; P8 3 4; R10 1 2; R12 1 2; R14 1 2; R16 1 2; R18 1 2; R20 1; R21 2; R22 1 2; R23 2; R24 1; R26 1; R27 1; R29 1; R32 1; R33 1; R35 1; R36 1; R37 1; R42 2; R50 2; R59 1 2; R60 1; R61 1; R62 1; R64 1; R65 1; R66 1 2; R67 1; R69 1 2; R70 1; R72 1; R73 1; R74 1; R75 1; R76 1; R78 1; R79 1; R80 1; R82 1 2; R83 1 2; R84 1 2; R85 1; R86 1; R89 1 2; R90 1; R91 1 2; R92 1; R97 1; R98 1; R99 1; R100 1; R103 1; R134 2; R135 1; R148 2; R149 1; R150 2; R151 1; U6 5(n.c.)

## Notes on the sheet
- Labels drawn without touching a wire or pin: VREF
- (in symbol 100uF) UWT1V101MCL1GS

## Library data of the parts
U3 = TB6612FNG: Manufacturer: TOSHIBA(东芝); Symbol: TB6612FNG,C,8,EL; Add into BOM: yes; Device: TB6612FNG,C,8,EL; LCSC Part Name: TB6612FNG,C,8,EL; Supplier Part: C141517; Manufacturer Part: TB6612FNG,C,8,EL; Supplier Footprint: SSOP-24; JLCPCB Part Class: Extended Part; Datasheet: https://atta.szlcsc.com/upload/public/pdf/source/20171128/C141517_15118625624231147036.pdf; Supplier: LCSC; Convert to PCB: yes
U4 = SLM6900: Manufacturer: SOLA-IC; Contributor: LCSC; Supplier: LCSC; Supplier Part: C388595; Manufacturer Part: SLM6900; JLCPCB Part Class: Extended Part; spicePre: U; spiceSymbolName: SLM6900
C1 C2 C5 C6 C13 C24 C32 C33 C39 = 100uF: Published: 8-Jun-2000; LatestRevisionDate: 29-May-2009; LatestRevisionNote: IPC-7351 Footprint Added.; Publisher: Altium Limited; PackageDescription: Chip Capacitor
  C1: PackageReference: C0805
C3 C12 C14-C21 C23 C28 C30 C36-C38 C40 C41 = 100nF (104) 10% 50V: ComponentLink1Description: 供应商链接; ComponentLink1URL: http://www.szlcsc.com/product/details_15331.html; Supplier: LC; SuppliersPartNumber: C14663
C4 C9 C34 C35 = 10nF (103) 10% 50V: ComponentLink1Description: 供应商链接; ComponentLink1URL: http://www.szlcsc.com/product/details_58143.html; Supplier: LC
  C9 C34 C35: SuppliersPartNumber: C57112
C7 = C: ComponentLink1Description: 供应商链接; ComponentLink1URL: http://www.szlcsc.com/product/details_15530.html; Supplier: LC; SuppliersPartNumber: C14858
C8 = 39pF: ComponentLink1Description: 供应商链接; ComponentLink1URL: http://www.szlcsc.com/product/details_15530.html; Supplier: LC; SuppliersPartNumber: C14858
C10 C11 = 22pF 50V: ComponentLink1Description: 供应商链接; ComponentLink1URL: http://www.szlcsc.com/product/details_2021.html; Supplier: LC; SuppliersPartNumber: C1669
C22 C29 = 10uF (106) 10% 10V: ComponentLink1Description: 供应商链接; ComponentLink1URL: http://www.szlcsc.com/product/details_20411.html; Supplier: LC; SuppliersPartNumber: C19702
C25 = 330nF (334) 10% 25V: ComponentLink1Description: 供应商链接; ComponentLink1URL: http://www.szlcsc.com/product/details_1967.html; Supplier: LC; SuppliersPartNumber: C1615
C26 = 2.2uF  10% 10V: ComponentLink1Description: 供应商链接; ComponentLink1URL: http://www.szlcsc.com/product/details_20411.html; Supplier: LC; SuppliersPartNumber: C19702
C31 = 2.2uF 10% 10V: ComponentLink1Description: 供应商链接; ComponentLink1URL: http://www.szlcsc.com/product/details_15331.html; Supplier: LC; SuppliersPartNumber: C14663
D1 D10 D11 D16-D19 = B340A: ComponentLink1Description: 供应商链接; ComponentLink1URL: http://www.szlcsc.com/product/details_10338.html; Supplier: LC; SuppliersPartNumber: C9808
D2 D4 = B5819W  SL: ComponentLink1Description: 供应商链接; ComponentLink1URL: http://www.szlcsc.com/product/details_9093.html; Supplier: LC; SuppliersPartNumber: C8598
D3 D13 D14 = 红灯 0603: ComponentLink1Description: 供应商链接; ComponentLink1URL: http://www.szlcsc.com/product/details_2659.html; Supplier: LC; SuppliersPartNumber: C2286
D5-D8 D15 = 绿灯 0603: ComponentLink1Description: 供应商链接; ComponentLink1URL: http://www.szlcsc.com/product/details_73152.html; Supplier: LC; SuppliersPartNumber: C72043
L1 L2 = IHLP2525CZER100M01: Supplier: LC; SuppliersPartNumber: C540965
  L1: ComponentLink1Description: 供应商链接
  L2: IHLP2525CZER100M01: http://www.szlcsc.com/product/details_1386.html
L3 = NLFC453232T-101K-PF: H: NLFC453232T-101K-PF; NLFC453232T-101K-PF: http://www.szlcsc.com/product/details_1386.html; Supplier: LC; SuppliersPartNumber: C1034
P1 = AFC12-S08DCC-00: LatestRevisionDate: 17-Jul-2002; LatestRevisionNote: Re-released for DXP Platform.; Publisher: Altium Limited
P2 = ZH-6PWB: LatestRevisionDate: 17-Jul-2002; LatestRevisionNote: Re-released for DXP Platform.; Publisher: Altium Limited
P3 P4 = UK-1.25-2AWT: LatestRevisionDate: 17-Jul-2002; LatestRevisionNote: Re-released for DXP Platform.; Publisher: Altium Limited
P5 P16 = Header 5: LatestRevisionDate: 17-Jul-2002; LatestRevisionNote: Re-released for DXP Platform.; Publisher: Altium Limited
P6 = UK-2.0-4AWT: LatestRevisionDate: 17-Jul-2002; LatestRevisionNote: Re-released for DXP Platform.; Publisher: Altium Limited
P7 P8 = A1001WR-S-2X08PD01: LatestRevisionDate: 17-Jul-2002; LatestRevisionNote: Re-released for DXP Platform.; Publisher: Altium Limited
P9 = UK-1.25-6AWT: LatestRevisionDate: 17-Jul-2002; LatestRevisionNote: Re-released for DXP Platform.; Publisher: Altium Limited
P10 P11 = UK-2.0-2AWT: LatestRevisionDate: 17-Jul-2002; LatestRevisionNote: Re-released for DXP Platform.; Publisher: Altium Limited
P12 = HC-XH-2AWT: LatestRevisionDate: 17-Jul-2002; LatestRevisionNote: Re-released for DXP Platform.; Publisher: Altium Limited
P13 = Header 4: LatestRevisionDate: 17-Jul-2002; LatestRevisionNote: Re-released for DXP Platform.; Publisher: Altium Limited
P14 = JY901S: LatestRevisionDate: 17-Jul-2002; LatestRevisionNote: Re-released for DXP Platform.; Publisher: Altium Limited
P15 = Header 6: LatestRevisionDate: 17-Jul-2002; LatestRevisionNote: Re-released for DXP Platform.; Publisher: Altium Limited
P17 P19 = IR1: LatestRevisionDate: 17-Jul-2002; LatestRevisionNote: Re-released for DXP Platform.; Publisher: Altium Limited
P18 = IR2: LatestRevisionDate: 17-Jul-2002; LatestRevisionNote: Re-released for DXP Platform.; Publisher: Altium Limited
P20 = Header 2: LatestRevisionDate: 17-Jul-2002; LatestRevisionNote: Re-released for DXP Platform.; Publisher: Altium Limited
P21 = LM7805: LatestRevisionDate: 17-Jul-2002; LatestRevisionNote: Re-released for DXP Platform.; Publisher: Altium Limited
Q1 = SS8550 Y2: ComponentLink1Description: 供应商链接; ComponentLink1URL: http://www.szlcsc.com/product/details_9037.html; Supplier: LC; SuppliersPartNumber: C8542
Q2 = NCE60P25: ComponentLink1Description: 供应商链接; ComponentLink1URL: http://www.szlcsc.com/product/details_15801.html; Supplier: LC; SuppliersPartNumber: C693433
Q3-Q6 = NCE6020AK: ComponentLink1Description: 供应商链接; ComponentLink1URL: http://www.szlcsc.com/product/details_21629.html; Supplier: LC; SuppliersPartNumber: C108639
R1 R4 R8 R28 R31 R45-R47 R49 R55 R56 R60 R64 R65 R71 = 1K ±1%: ComponentLink1Description: 供应商链接; Supplier: LC
  R1 R4 R46 R49: ComponentLink1URL: http://www.szlcsc.com/product/details_23924.html; SuppliersPartNumber: C23197
  R8 R28 R31 R45 R47 R55 R56 R60 R64 R65: ComponentLink1URL: http://www.szlcsc.com/product/details_17853.html; SuppliersPartNumber: C17168
  R71: ComponentLink1URL: http://www.szlcsc.com/product/details_26546.html; SuppliersPartNumber: C25803
R2 R44 R48 R52-R54 = 51Ω (51R0) ±1%: ComponentLink1Description: 供应商链接; ComponentLink1URL: http://www.szlcsc.com/product/details_23924.html; Supplier: LC; SuppliersPartNumber: C23197
R3 R5-R7 R9-R27 R29 R32-R42 R50 R57-R59 R62 R66 R67 R69 R70 R72-R76 R78-R86 R89-R92 R97-R100 R103 R143 = 0Ω (0R0) ±1%: ComponentLink1Description: 供应商链接; Supplier: LC
  R3 R5-R7 R9-R27 R29 R32-R42 R50 R57-R59 R62 R66 R67 R69 R70 R72-R76 R78-R80 R82-R86 R89-R92 R97-R100 R103: ComponentLink1URL: http://www.szlcsc.com/product/details_17853.html; SuppliersPartNumber: C17168
  R81 R143: ComponentLink1URL: http://www.szlcsc.com/product/details_21903.html; SuppliersPartNumber: C21189
R30 R68 R77 R101 R104 R138 R139 R152 R153 = 100KΩ (1003) ±1%: ComponentLink1Description: 供应商链接; ComponentLink1URL: http://www.szlcsc.com/product/details_26546.html; Supplier: LC; SuppliersPartNumber: C25803
R43 R51 = 5.1K ±1%: ComponentLink1Description: 供应商链接; ComponentLink1URL: http://www.szlcsc.com/product/details_23924.html; Supplier: LC; SuppliersPartNumber: C23197
R61 = 1K±1%: ComponentLink1Description: 供应商链接; ComponentLink1URL: http://www.szlcsc.com/product/details_17853.html; Supplier: LC; SuppliersPartNumber: C17168
R63 = 1KΩ  ±1%: ComponentLink1Description: 供应商链接; ComponentLink1URL: http://www.szlcsc.com/product/details_23913.html; Supplier: LC; SuppliersPartNumber: C23186
R87 = 10.2KΩ (1002) ±1%: ComponentLink1Description: 供应商链接; ComponentLink1URL: http://www.szlcsc.com/product/details_26547.html; Supplier: LC; SuppliersPartNumber: C25804
R88 = 330KΩ  ±1%: ComponentLink1Description: 供应商链接; ComponentLink1URL: http://www.szlcsc.com/product/details_23864.html; Supplier: LC; SuppliersPartNumber: C23137
R93 = 1.91KΩ (1002) ±1%: ComponentLink1Description: 供应商链接; ComponentLink1URL: http://www.szlcsc.com/product/details_26547.html; Supplier: LC; SuppliersPartNumber: C25804
R94 R105 R108 R110 R129 R130 R146 R147 = 10KΩ (1002) ±1%: ComponentLink1Description: 供应商链接; Supplier: LC
  R94 R108 R129 R130 R146 R147: ComponentLink1URL: http://www.szlcsc.com/product/details_26547.html; SuppliersPartNumber: C25804
  R105 R110: ComponentLink1URL: http://www.szlcsc.com/product/details_26487.html; SuppliersPartNumber: C25744
R95 = 68KΩ: ComponentLink1Description: 供应商链接; ComponentLink1URL: http://www.szlcsc.com/product/details_23864.html; Supplier: LC; SuppliersPartNumber: C23137
R96 = 50KΩ (1002) ±1%: ComponentLink1Description: 供应商链接; ComponentLink1URL: http://www.szlcsc.com/product/details_26547.html; Supplier: LC; SuppliersPartNumber: C25804
R102 = 31KΩ ±1%: ComponentLink1Description: 供应商链接; ComponentLink1URL: http://www.szlcsc.com/product/details_26554.html; Supplier: LC; SuppliersPartNumber: C25811
R106 R122 = 5.1KΩ ±1%: ComponentLink1Description: 供应商链接; ComponentLink1URL: http://www.szlcsc.com/product/details_26547.html; Supplier: LC; SuppliersPartNumber: C25804
R107 = 1MΩ (1004) ±1%: ComponentLink1Description: 供应商链接; ComponentLink1URL: http://www.szlcsc.com/product/details_23662.html; Supplier: LC; SuppliersPartNumber: C22935
R109 R111 R114 R115 R141 R142 R144 R145 R154-R157 = 0.1Ω (R100) ±1%: ComponentLink1Description: 供应商链接; ComponentLink1URL: http://www.szlcsc.com/product/details_26077.html; Supplier: LC; SuppliersPartNumber: C25334
R112 = 5.1KΩ  ±1%: ComponentLink1Description: 供应商链接; ComponentLink1URL: http://www.szlcsc.com/product/details_26547.html; Supplier: LC; SuppliersPartNumber: C25804
R113 R118 = 2KΩ (2002) ±1%: ComponentLink1Description: 供应商链接; ComponentLink1URL: http://www.szlcsc.com/product/details_26547.html; Supplier: LC; SuppliersPartNumber: C25804
R116 = 4.7KΩ (4701) ±1%: ComponentLink1Description: 供应商链接; ComponentLink1URL: http://www.szlcsc.com/product/details_23889.html; Supplier: LC; SuppliersPartNumber: C23162
R117 = 20K: ComponentLink1Description: 供应商链接; ComponentLink1URL: http://www.szlcsc.com/product/details_23514.html; Supplier: LC; SuppliersPartNumber: C22787
R119 R133 = 1Ω  ±1%: ComponentLink1Description: 供应商链接; ComponentLink1URL: http://www.szlcsc.com/product/details_26547.html; Supplier: LC; SuppliersPartNumber: C25804
R120 R128 = 3K: ComponentLink1Description: 供应商链接; ComponentLink1URL: http://www.szlcsc.com/product/details_23514.html; Supplier: LC; SuppliersPartNumber: C22787
R121 R123 = 0.4Ω (1000) ±1%: ComponentLink1Description: 供应商链接; ComponentLink1URL: http://www.szlcsc.com/product/details_18589.html; Supplier: LC; SuppliersPartNumber: C17901
R124 = 20k: ComponentLink1Description: 供应商链接; ComponentLink1URL: http://www.szlcsc.com/product/details_23514.html; Supplier: LC; SuppliersPartNumber: C22787
R125-R127 = 120Ω (1200) ±1%: ComponentLink1Description: 供应商链接; ComponentLink1URL: http://www.szlcsc.com/product/details_23514.html; Supplier: LC; SuppliersPartNumber: C22787
R131 = 39.3K ±1%: ComponentLink1Description: 供应商链接; ComponentLink1URL: http://www.szlcsc.com/product/details_23514.html; Supplier: LC; SuppliersPartNumber: C22787
R132 = 10Ω  ±1%: ComponentLink1Description: 供应商链接; ComponentLink1URL: http://www.szlcsc.com/product/details_26547.html; Supplier: LC; SuppliersPartNumber: C25804
R134-R137 R148-R151 = 1KΩ (1001) ±1%: ComponentLink1Description: 供应商链接; ComponentLink1URL: http://www.szlcsc.com/product/details_21904.html; Supplier: LC; SuppliersPartNumber: C21190
R158 = 120Ω: ComponentLink1Description: 供应商链接; ComponentLink1URL: http://www.szlcsc.com/product/details_18589.html; Supplier: LC; SuppliersPartNumber: C17901
S1 = SW-PB: Published: 24-Mar-1999; LatestRevisionDate: 17-Jul-2002; LatestRevisionNote: Re-released for DXP Platform.; PackageReference: SPST-2; Publisher: Altium Limited; PackageDescription: Switch; 2 Leads
S2 S3 = DTSM-65Y-V-T/R: Published: 24-Mar-1999; LatestRevisionDate: 17-Jul-2002; LatestRevisionNote: Re-released for DXP Platform.; PackageReference: DPST-4; Publisher: Altium Limited; PackageDescription: Switch; 4 Leads
U1#1-U1#5 = STM32F407VET6: ComponentLink1Description: 供应商链接; ComponentLink1URL: http://www.szlcsc.com/product/details_29482.html; Supplier: LC; SuppliersPartNumber: C28730
U2 = TPS54331DR: ComponentLink1Description: 供应商链接; ComponentLink1URL: http://www.szlcsc.com/product/details_10397.html; Supplier: LC; SuppliersPartNumber: C9865
U5#1-U5#5 = 74HC14D: ComponentLink1Description: 供应商链接; ComponentLink1URL: http://www.szlcsc.com/product/details_6056.html; Supplier: LC; SuppliersPartNumber: C5605
U6 = CAN/TJA1050T/CM: ComponentLink1Description: 供应商链接; ComponentLink1URL: http://www.szlcsc.com/product/details_7424.html; Supplier: LC; SuppliersPartNumber: C6952
VR1 = AMS1117-3.3: ComponentLink1Description: 供应商链接; ComponentLink1URL: http://www.szlcsc.com/product/details_6652.html; Supplier: LC; SuppliersPartNumber: C2904742
Y1 = 8MHz ±20ppm 20pF: ComponentLink1Description: 供应商链接; ComponentLink1URL: http://www.szlcsc.com/product/details_117214.html; Supplier: LC; SuppliersPartNumber: C115962